# EAGLE board base (EAGLE 9.5.1)
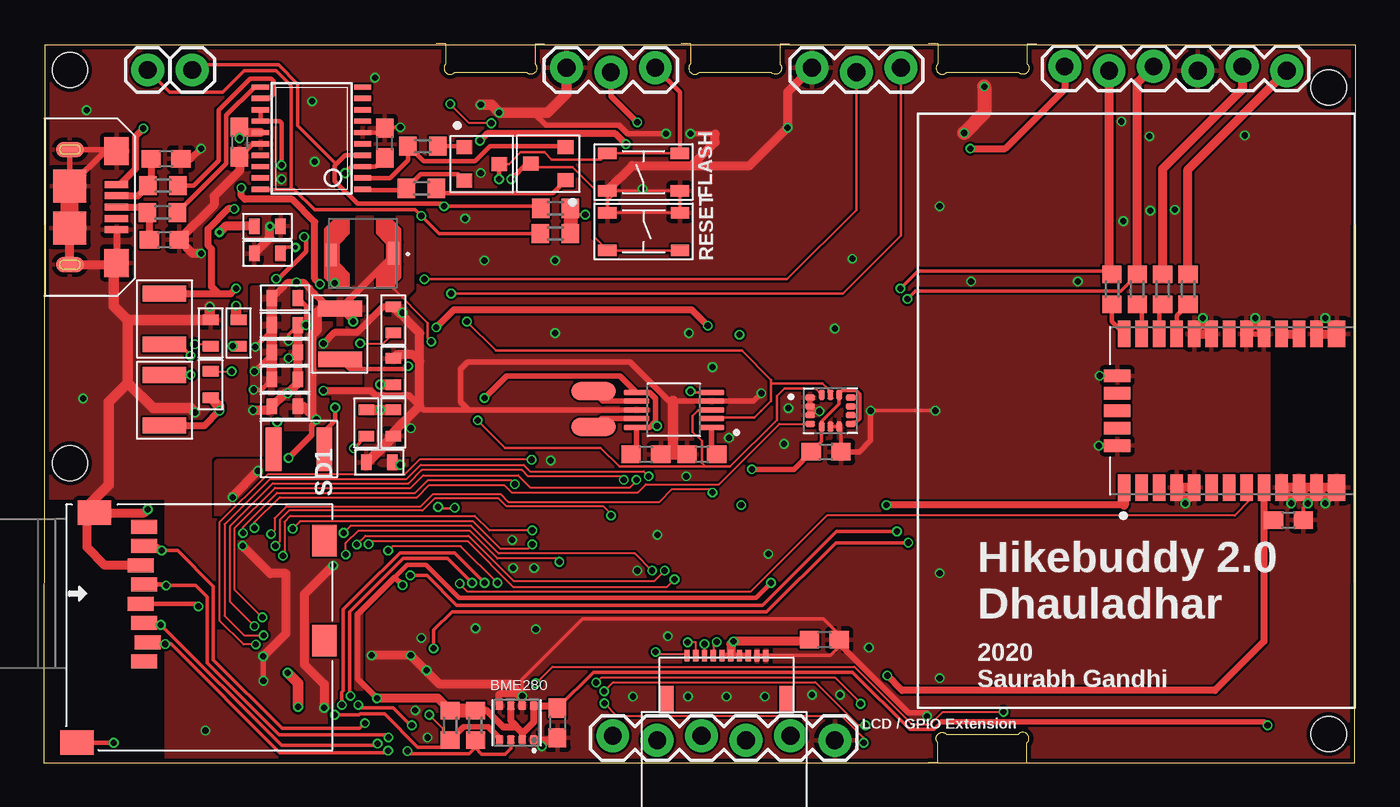
[diagram p2: board, top side]
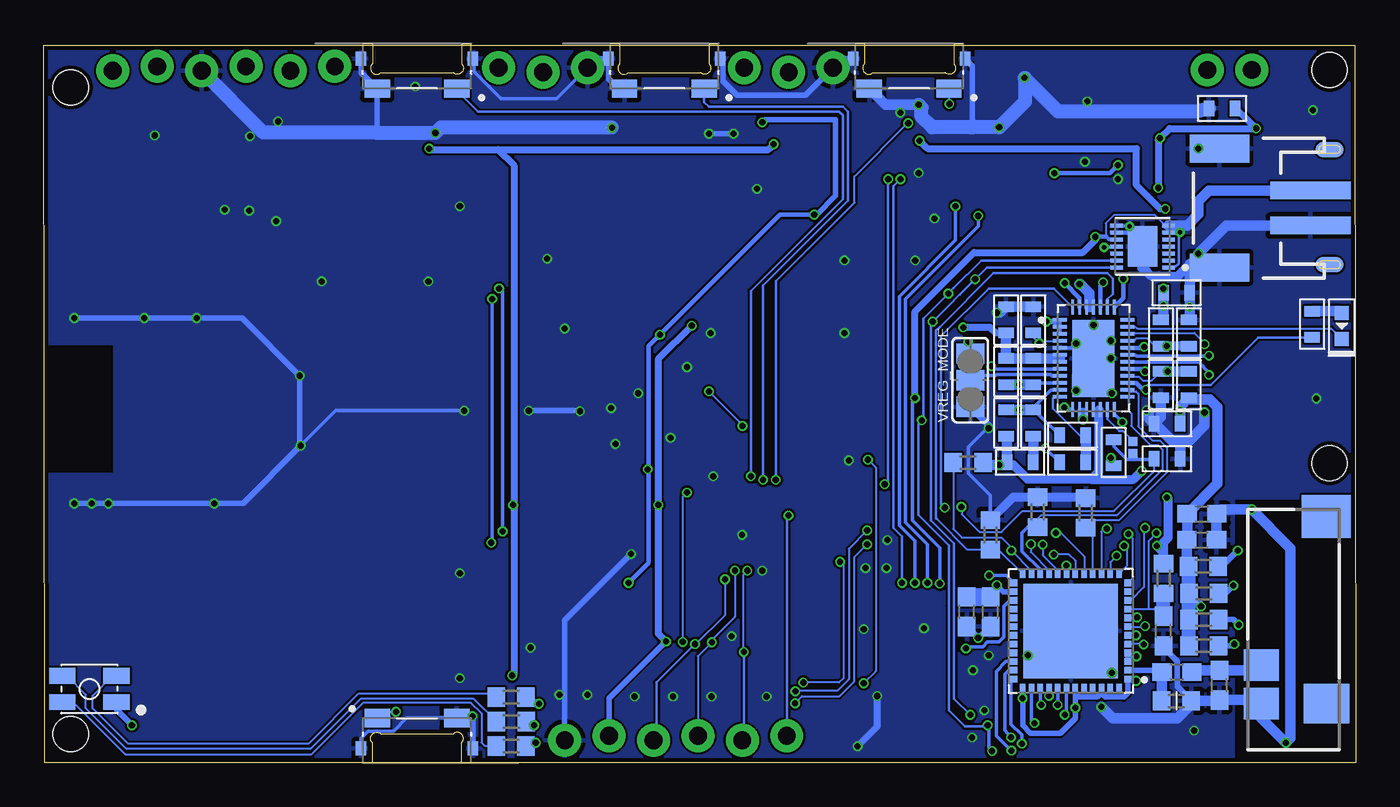
[diagram p3: board, bottom side, seen from below]

Size 75.05 x 41.05 mm. Coordinates in mm from the lower left corner, seen from the top.
Outline: 0,0 75,0 75.05,41.05 0.05,41.05 0,0
Copper layers (1*16): Top 0.035mm / dielectric 1.5mm / Bottom 0.035mm
Design rules "MF_4_mil_drill_2_Layer": minimum track width 5mil, minimum drill 4mil, track to track 5mil, track to pad 5mil, pad to pad 5mil, via to via 5mil, smd to smd 0mil, copper to edge 10mil, drill to drill 10mil, minimum pad ring 4mil, minimum via ring 4mil, stop-mask expansion 2mil, vias tented up to drill 25mil, thermal gap 10mil
Holes 2 mm at 73.5,38.65 73.5,1.65 1.5,39.65 1.5,17.15
tKeepout: area 71,18.1 to 75,22.1
bKeepout: area 71,18.1 to 75,22.1

## Footprints (pad centres in the part's own frame; a part is rotated, then mirrored left to right if it is on the bottom)
PRO-OB-440_1 = smd 2 x 1.8: 1 1.865,-2.65; 2 1.865,-4.85 | smd 2.6 x 2.25: 3 -1.865,-2.65 | smd 2.8 x 2.45: 4 -1.865,-13.35
JST-2-SMD = smd 1 x 4.6: 1 -1,-3.7; 2 1,-3.7 | smd 1.6 x 3.4: NC1 -3.4,1.5; NC2 3.4,1.5
PSON65P250X250X100-8N = smd 0.49 x 0.45: 1 0.97,0.975; 2 0.97,0.325; 3 0.97,-0.325; 4 0.97,-0.975; 5 -0.97,-0.975; 6 -0.97,-0.325; 7 -0.97,0.325; 8 -0.97,0.975
C0603 = smd 1.1 x 1: 1 -0.85,0; 2 0.85,0
C0603' = smd 0.6 x 0.9: P$1 -0.75,0; P$2 0.75,0
LED0603 = smd 0.8 x 0.8: ANODE 0.75,0; CATHODE -0.75,0
PLCC4 = smd 1.5 x 0.9: P$1 -1.55,0.75; P$2 -1.55,-0.75; P$3 1.55,-0.75; P$4 1.55,0.75
PQFN50P700X700X104-49N = smd 0.45 x 0.35: 1 -3.265,2.75; 2 -3.265,2.25; 3 -3.265,1.75; 4 -3.265,1.25; 5 -3.265,0.75; 6 -3.265,0.25; 7 -3.265,-0.25; 8 -3.265,-0.75; 9 -3.265,-1.25; 10 -3.265,-1.75; 11 -3.265,-2.25; 12 -3.265,-2.75; 25 3.265,-2.75; 26 3.265,-2.25; 27 3.265,-1.75; 28 3.265,-1.25; 29 3.265,-0.75; 30 3.265,-0.25; 31 3.265,0.25; 32 3.265,0.75; 33 3.265,1.25; 34 3.265,1.75; 35 3.265,2.25; 36 3.265,2.75 | smd 0.35 x 0.45: 13 -2.75,-3.265; 14 -2.25,-3.265; 15 -1.75,-3.265; 16 -1.25,-3.265; 17 -0.75,-3.265; 18 -0.25,-3.265; 19 0.25,-3.265; 20 0.75,-3.265; 21 1.25,-3.265; 22 1.75,-3.265; 23 2.25,-3.265; 24 2.75,-3.265; 37 2.75,3.265; 38 2.25,3.265; 39 1.75,3.265; 40 1.25,3.265; 41 0.75,3.265; 42 0.25,3.265; 43 -0.25,3.265; 44 -0.75,3.265; 45 -1.25,3.265; 46 -1.75,3.265; 47 -2.25,3.265; 48 -2.75,3.265 | smd 5.4 x 5.4: 49 0,0
TACT4.2MM = smd 1.05 x 0.65: P$1 -2.075,1.075; P$2 2.075,1.075; P$3 -2.075,-1.075; P$4 2.075,-1.075
TSSOP20 = smd 0.305 x 0.991: 1 -2.925,-2.918; 2 -2.275,-2.918; 3 -1.625,-2.918; 4 -0.975,-2.918; 5 -0.325,-2.918; 6 0.325,-2.918; 7 0.975,-2.918; 8 1.625,-2.918; 9 2.275,-2.918; 10 2.925,-2.918; 11 2.925,2.918; 12 2.275,2.918; 13 1.625,2.918; 14 0.975,2.918; 15 0.325,2.918; 16 -0.325,2.918; 17 -0.975,2.918; 18 -1.625,2.918; 19 -2.275,2.918; 20 -2.925,2.918
MICROUSB-RIGHT = smd 0.4 x 1.35: 1 -1.3,1.27; 2 -0.65,1.27; 3 0,1.27; 4 0.65,1.27; 5 1.3,1.27 | smd 0.9 x 1.6: S1 -3.3,-1.4; S2 3.3,-1.4 | smd 1.6 x 1.4: S3 -3.2,1.27; S4 3.2,1.27 | smd 1.9 x 1.9: S5 -1.2,-1.405; S6 1.2,-1.405 | smd 0.9 x 1.6 bottom: S7 -3.3,-1.4; S8 3.3,-1.4
1X06_LOCK = drill 1.016 pad 1.88: 1 0,0; 2 2.54,-0.254; 3 5.08,0; 4 7.62,-0.254; 5 10.16,0; 6 12.7,-0.254
1X03_LOCK = drill 1.016 pad 1.88: 1 0,0.127; 2 2.54,-0.127; 3 5.08,0.127
SOLDER_PAD_2 = smd 1.016 x 2.54: P$1 -1.016,0; P$2 1.016,0
1X01 = drill 1.016 pad 1.88: 1 0,0
L0603 = smd 1 x 1.1: 1 -0.85,0; 2 0.85,0
INDP_LPS4018-472MRB = smd 0.635 x 1.27: 1 -1.77,0; 2 1.81,0.1
L1210 = smd 0.9 x 2.5: P$1 -1.45,0; P$2 1.45,0
R0603 = smd 1 x 1.1: 1 -0.85,0; 2 0.85,0
R0603' = smd 0.6 x 0.9: P$1 -0.75,0; P$2 0.75,0
SW_EVQ-P4HB3B = smd 1.45 x 1.05: 1 -2.275,0.875; 2 2.275,0.875 | smd 0.6 x 0.8: 3 -3.2,-0.85; 4 3.2,-0.85
MF-MICROSD = smd 1.4 x 1.9: G0 -6.589,7.001; G1 6.561,6.001 | smd 0.8 x 1.5: PIN1 -1.939,3.151; PIN2 -0.839,2.951; PIN3 0.261,3.151; PIN4 1.361,3.351; PIN5 2.461,3.151; PIN6 3.561,3.351; PIN7 4.661,3.151; PIN8 5.761,3.151 | smd 1.8 x 1.4: PIN9 4.961,-7.149; PIN10 -0.739,-7.149
PAD.02X.02 = smd 0.508 x 0.508: P$1 0,0
QFN40P600X400X80-39N = smd 0.86 x 0.22: 1 -1.935,2.2; 2 -1.935,1.8; 3 -1.935,1.4; 4 -1.935,1; 5 -1.935,0.6; 6 -1.935,0.2; 7 -1.935,-0.2; 8 -1.935,-0.6; 9 -1.935,-1; 10 -1.935,-1.4; 11 -1.935,-1.8; 12 -1.935,-2.2; 20 1.935,-2.2; 21 1.935,-1.8; 22 1.935,-1.4; 23 1.935,-1; 24 1.935,-0.6; 25 1.935,-0.2; 26 1.935,0.2; 27 1.935,0.6; 28 1.935,1; 29 1.935,1.4; 30 1.935,1.8; 31 1.935,2.2 | smd 0.22 x 0.86: 13 -1.2,-2.935; 14 -0.8,-2.935; 15 -0.4,-2.935; 16 0,-2.935; 17 0.4,-2.935; 18 0.8,-2.935; 19 1.2,-2.935; 32 1.2,2.935; 33 0.8,2.935; 34 0.4,2.935; 35 0,2.935; 36 -0.4,2.935; 37 -0.8,2.935; 38 -1.2,2.935 | smd 2.4 x 4.4: 39 0,0
SON40P300X300X80-15N = smd 0.76 x 0.22: 1 -1.485,1.2; 2 -1.485,0.8; 3 -1.485,0.4; 4 -1.485,0; 5 -1.485,-0.4; 6 -1.485,-0.8; 7 -1.485,-1.2; 8 1.485,-1.2; 9 1.485,-0.8; 10 1.485,-0.4; 11 1.485,0; 12 1.485,0.4; 13 1.485,0.8; 14 1.485,1.2 | smd 1.7 x 2.3: 15 0,0
SOT-23-3 = smd 0.9 x 0.8: P$1 -1,0.95; P$2 -1,-0.95; P$3 1,0
SOP50P490X110-10N = smd 1.44 x 0.3: 1 -2.145,1; 2 -2.145,0.5; 3 -2.145,0; 4 -2.145,-0.5; 5 -2.145,-1; 6 2.145,-1; 7 2.145,-0.5; 8 2.145,0; 9 2.145,0.5; 10 2.145,1
PQFN50P250X300X100-14N = smd 0.58 x 0.35: 1 -1.16,0.75; 2 -1.16,0.25; 3 -1.16,-0.25; 4 -1.16,-0.75; 8 1.16,-0.75; 9 1.16,-0.25; 10 1.16,0.25; 11 1.16,0.75 | smd 0.35 x 0.58: 5 -0.5,-0.91; 6 0,-0.91; 7 0.5,-0.91; 12 0.5,0.91; 13 0,0.91; 14 -0.5,0.91
FH12-10S-0.5SH = smd 0.3 x 0.655: DISP -0.25,5.25; EXTCOMIN -0.75,5.25; EXTMODE 1.25,5.25; SCLK -2.25,5.25; SCS -1.25,5.25; SI -1.75,5.25; VDD 0.75,5.25; VDDA 0.25,5.25; VSS 1.75,5.25; VSSA 2.25,5.25 | smd 0.85 x 1.5: P$1 -3.45,2.75; P$2 3.45,2.75
LCC100P960X1400X210-31N = smd 1.5 x 0.7: 1 4.4,-6.2; 2 4.4,-5.2; 3 4.4,-4.2; 4 4.4,-3.2; 5 4.4,-2.2; 6 4.4,-1.2; 7 4.4,-0.2; 8 4.4,0.8; 9 4.4,1.8; 10 4.4,2.8; 11 4.4,3.8; 12 4.4,4.8; 15 -4.4,4.8; 16 -4.4,3.8; 17 -4.4,2.8; 18 -4.4,1.8; 19 -4.4,0.8; 20 -4.4,-0.2; 21 -4.4,-1.2; 22 -4.4,-2.2; 23 -4.4,-3.2; 24 -4.4,-4.2; 25 -4.4,-5.2; 26 -4.4,-6.2 | smd 1.5 x 1: 13 4.4,5.95; 14 -4.4,5.95 | smd 0.7 x 1.5: 27 -2,-6.6; 28 -1,-6.6; 29 0,-6.6; 30 1,-6.6; 31 2,-6.6
SJ_2 = smd 1.168 x 1.6: 1 -1.524,0; 2 0,0; 3 1.524,0

## Placement (x,y rotation side)
ANT  PRO-OB-440  [PRO-OB-440_1]  3.55,0.75 180 bottom
BATTERY1  S2B-PH-SM4-TB(LF)(SN)  [JST-2-SMD]  6.3,31.75 90 bottom
BME280  BME280  [PSON65P250X250X100-8N]  27.05,2.3 270 top
C1  4.7pF  [C0603]  10.23,5.21 0 bottom
C2  4.7pF  [C0603]  7.8,4.45 90 bottom
C3  0.1uF  [C0603]  11,7.55 90 bottom
C4  0.1uF  [C0603]  19.5,35.47 90 top
C5  47pF  [C0603]  7,34.57 0 top
C6  47pF  [C0603]  6.89,29.93 0 top
C7  10uF  [C0603]  11.21,35.53 270 top
C8  10uF  [C0603]  22.25,8.65 90 bottom
C9  10uF  [C0603']  7.65,37.45 180 bottom
C10  0.1uF  [C0603']  20,25.35 270 top
C11  22uF  [C0603']  18.45,22.4 90 bottom
C12  22uF  [C0603']  13.8,26.6 180 top
C13  10pF  [C0603']  11.15,24.6 270 bottom
C14  0.1uF  [C0603]  8.8,14.25 0 bottom
C15  0.1uF  [C0603]  8.82,12.76 0 bottom
C16  10uF  [C0603']  10.25,26.9 180 bottom
C17  4.7uF  [C0603]  71.2,13.9 0 top
C18  10pF  [C0603']  9.55,21.65 90 bottom
C19  4.7uF  [C0603]  44.65,7.05 180 top
C20  0.1uF  [C0603']  10.8,17.4 180 bottom
C21  10uF  [C0603]  44.75,17.8 0 top
C23  10uF  [C0603]  29.39,2.29 270 top
C24  10uF  [C0603']  10.8,19.4 180 bottom
C25  1uF  [C0603']  13.8,25.05 180 top
C26  1uF  [C0603']  13.8,23.5 180 top
C27  10uF  [C0603']  13.8,21.95 180 top
C28  10uF  [C0603']  13.8,20.4 0 top
C29  22uF  [C0603']  20,25.35 270 bottom
C30  22uF  [C0603']  19.2,17.2 180 top
C31  33pF  [C0603']  18.45,19.45 270 bottom
C32  330pF  [C0603']  18.45,19.45 270 top
C33  10pF  [C0603']  16.2,18.75 0 bottom
C34  0.47uF  [C0603']  12.8,29.15 0 top
C35  0.1uF  [C0603']  12.8,30.7 180 top
C36  4.7uF  [C0603]  37.65,17.65 180 top
C37  4.7uF  [C0603]  34.45,17.65 180 top
C38  10uF  [C0603]  20.9,8.65 90 bottom
D1  MF-LED-0603-RED  [LED0603]  0.8,25 90 bottom
D4  MF-LED-3228-RGB  [PLCC4]  72.44,4.23 180 bottom
ESP32-PICO-D4  ESP32-PICO-D4  [PQFN50P700X700X104-49N]  16.3,7.55 180 bottom
FLASH  MF-SW-TACT-4.2MM  [TACT4.2MM]  34.31,33.8 0 top
FT231  FT231XS  [TSSOP20]  15.32,35.74 90 top
J1  MF-CON-MICROUSB-RIGHT  [MICROUSB-RIGHT]  2.9,31.8 270 top
J2  GPS Port  [1X06_LOCK]  71.1,39.6 180 top
J3  [1X03_LOCK]  43.95,39.65 0 top
J4  [1X03_LOCK]  29.9,39.65 0 top
J5  SOLDER_PAD_2  [SOLDER_PAD_2]  31.45,20.25 270 top
J6  [1X01]  5.95,39.65 0 top
J7  [1X01]  8.5,39.65 0 top
J8  [1X06_LOCK]  45.25,1.3 180 top
L1  30Ω/1.8A  [L0603]  10.26,3.55 0 bottom
L2  3.3uH  [INDP_LPS4018-472MRB]  18.25,29.15 180 top
L3  2.2uH  [L1210]  14.6,17.95 0 top
L4  4.7uH  [L1210]  6.9,25.4 270 top
L5  2.2uH  [L1210]  16.95,24.55 90 top
L6  4.7uH  [L1210]  6.9,20.75 270 top
R1  10k  [R0603]  11,10.55 90 bottom
R2  10k  [R0603]  22.18,17.18 0 bottom
R3  27  [R0603]  6.83,33.03 0 top
R4  27  [R0603]  6.79,31.49 0 top
R5  10k  [R0603]  21.68,35.29 0 top
R6  10k  [R0603]  21.61,32.88 0 top
R7  2K  [R0603']  9.55,24.6 270 top
R8  3K  [R0603']  18.45,25.35 270 bottom
R9  560K  [R0603']  20,22.4 90 bottom
R10  1k  [R0603]  29.28,31.73 0 top
R11  1k  [R0603]  29.27,30.29 0 top
R12  10k  [R0603]  8.7,6.7 180 bottom
R13  10k  [R0603]  8.7,8.2 180 bottom
R14  10k  [R0603]  8.7,9.7 180 bottom
R15  100  [R0603]  62.55,27.1 270 top
R16  1K  [R0603']  13.85,17.75 90 bottom
R17  100  [R0603]  61.1,27.1 90 top
R18  100  [R0603]  65.45,27.1 90 top
R19  100  [R0603]  64,27.1 90 top
R20  100K  [R0603']  20,22.4 270 top
R21  1K  [R0603']  2.5,25.1 270 bottom
R22  220K  [R0603']  9.55,24.6 90 bottom
R23  680K  [R0603']  11.15,24.6 270 top
R24  220K  [R0603']  11.15,21.65 270 bottom
R25  680K  [R0603']  9.55,21.65 90 top
R26  680K  [R0603']  20,19.45 270 bottom
R27  220K  [R0603']  20,19.45 90 top
R28  121K  [R0603']  19.2,17.2 180 bottom
R29  15K  [R0603']  16.2,17.2 0 bottom
R30  10k  [R0603]  18.2,14.35 270 bottom
R31  10k  [R0603]  15.45,14.3 270 bottom
R36  10k  [R0603]  20.9,13.05 270 bottom
R37  2K  [R0603]  23.25,2.15 90 top
R38  2K  [R0603]  24.7,2.15 90 top
R40  1k  [R0603]  48.31,3.77 180 bottom
R41  1k  [R0603]  48.31,0.97 180 bottom
R42  1k  [R0603]  48.3,2.37 180 bottom
R43  10k  [R0603]  8.72,11.25 180 bottom
RESET  MF-SW-TACT-4.2MM  [TACT4.2MM]  34.32,30.4 180 top
S1  EVQ-P4HB3B  [SW_EVQ-P4HB3B]  53.7,1.7 0 bottom
S2  EVQ-P4HB3B  [SW_EVQ-P4HB3B]  39.55,39.45 180 bottom
S3  EVQ-P4HB3B  [SW_EVQ-P4HB3B]  25.55,39.45 180 bottom
S4  EVQ-P4HB3B  [SW_EVQ-P4HB3B]  53.7,39.45 180 bottom
SD1  MF-MICROSD  [MF-MICROSD]  8.9,7.75 90 top
TP1  TEST-POINT2  [PAD.02X.02]  12.75,17.7 0 bottom
TP2  TEST-POINT2  [PAD.02X.02]  12.75,18.4 0 bottom
U1  LTC3586EUFE-1#PBF  [QFN40P600X400X80-39N]  15,23.15 0 bottom
U2  MAX17260SETD+  [SON40P300X300X80-15N]  12.2,29.55 180 bottom
U3  MF-DSC-SOT233-MMBT3904  [SOT-23-3]  25.05,34.27 0 top
U4  MF-DSC-SOT233-MMBT3904  [SOT-23-3]  28.86,34.28 180 top
U5  DRV2605LTDGSRQ1  [SOP50P490X110-10N]  36.05,20.2 180 top
U6  BMX160  [PQFN50P250X300X100-14N]  45,20.15 0 top
U$5  51441-1093  [FH12-10S-0.5SH]  39.05,0.9 0 top
UBLOX_GPS  CAM-M8C-0  [LCC100P960X1400X210-31N]  68,20.15 270 top
VREG_MODE  VREG MODE  [SJ_2]  22.05,21.9 90 bottom

## Tracks (layer width: path | path; a pad name or v marks a point on that pad's centre or on a via)
3V3_GPS  (via drill 0.35)
  Top 0.2: 70.3,13.85 C17.1
  Top 0.305: 69.8,14.35 70.3,13.85
  Top 0.406: L4.P$1 10,26.85 | 10,26.85 10.7,26.85 v11,27.15 | 10,26.85 9.61,27.24 9.61,29.4 9.4,29.61 9.4,30.56 10.54,31.7 v10.9,31.7 | J2.6 58.4,38.55 55,35.15 v53,35.15 | v24.95,35.6 25.35,36 32.7,36 v33.3,35.4 | UBLOX_GPS.9 69.8,14.35 69.8,6.95 67,4.15 49.1,4.15 v48.25,5 | 61.8,14.75 v48.2,14.75
  Top 0.508: UBLOX_GPS.1 61.8,14.75
  Top 0.61: R23.P$1 11,25.5 v11,26.15
  Bottom 0.305: 48.15,14.7 v48.2,14.75 48.15,14.8 | 52.95,35.1 49.05,35.1
  Bottom 0.406: v11,27.15 C16.P$2 | v10.9,31.7 11.2,31.7 12.55,33.05 12.55,35.15 24.5,35.15 v24.95,35.6 | v53,35.15 52.95,35.1 33.6,35.1 v33.3,35.4 | 48.15,14.7 48.15,5.1 v48.25,5 | 48.15,14.8 48.15,34.2 49.05,35.1
  Bottom 0.61: C16.P$2 v11,26.15 11,25.5 R23.P$1
3V3_SDC  (via drill 0.35)
  Top 0.254: SD1.PIN4 8.69,9.11 v8.85,8.95
  Top 0.406: L6.P$2 9.2,19.3 v10.05,20.15
  Top 0.61: R25.P$1 10.05,20.4 v10.05,20.15
  Bottom 0.508: v8.85,8.95 9.05,9.15 9.55,9.15
  Bottom 0.61: v10.05,20.15 C24.P$1 10.05,20.4 R25.P$1 9.44,20.79 8.35,20.79 7.91,20.36 7.91,15.99 C14.1 9.65,12.78 C15.1 9.67,11.35 9.55,11.23
  Bottom 0.813: R12.2 R13.2 9.55,9.15 R14.2 9.55,11.23 R43.2
BMX_INT  (via drill 0.35)
  Top 0.127: v12.05,13.45 12.05,13.75 13.5,15.2 21.36,15.2 22.05,15.9 26.34,15.9 26.76,15.48 33.99,15.48 34.44,15.93 38.62,15.93 42.08,19.4 U6.4
  Bottom 0.127: ESP32-PICO-D4.10 13,9.34 12.84,9.34 12.12,10.06 12.12,13.38 v12.05,13.45
D+
  Top 0.406: J1.3 5.63,31.8 R4.1 6.04,31.39 C6.1
D-
  Top 0.406: J1.2 5.4,32.45 R3.1 6.14,33.2 C5.1
EN_GPS
  Bottom 0.127: U1.21 12.97,21.25 12.57,21.25 12.44,21.12 12.44,19.25 11.63,18.45 11.22,18.45 10.81,18.03 10.81,16.62 13.55,13.88 15.03,13.88 R31.2 15.05,13.05 ESP32-PICO-D4.16
EN_LCD
  Bottom 0.127: ESP32-PICO-D4.24 20.43,12.2 R36.2 22.2,12.2 23.95,13.95
  Bottom 0.15: 23.95,13.95 24.01,14 24.01,24.74 23.8,24.95
  Bottom 0.152: U1.33 14.2,26.54 13.9,26.84 13.9,27.72 14.2,28.02 20.73,28.02 23.8,24.95
EN_SDC
  Bottom 0.127: U1.20 13,20.89 13,20.15 12.85,20 12.85,19.29 11.75,18.19 11.32,18.19 11.06,17.93 11.06,16.78 13.68,14.16 18.01,14.16 18.2,13.97 R30.2
  Bottom 0.203: R30.2 18.75,13.5 19.1,13.15 19.1,12.12 18.05,11.06 ESP32-PICO-D4.22
ESP_EN  (via drill 0.35)
  Top 0.127: v11.4,13.15 11.4,13.5 13.35,15.45 21.25,15.45 21.95,16.15 26.75,16.15 v26.95,15.95
  Top 0.15: U4.P$3 28.05,34.08 30.24,34.08 31.49,32.83 31.49,30.07 RESET.P$2 RESET.P$1
  Top 0.254: U4.P$3 27.63,34.28 v26.75,33.4
  Bottom 0.127: ESP32-PICO-D4.9 11.85,8.8 | 11.85,8.8 11.39,8.8 | v11.4,13.15 11.85,12.7 11.85,8.8
  Bottom 0.15: v26.75,33.4 26.75,16.15 v26.95,15.95
  Bottom 0.305: 11.39,8.8 C3.2
  Bottom 0.813: C3.2 R1.1
ESP_FLASH  (via drill 0.35)
  Top 0.127: v25.95,10.3 23.85,12.4 19.95,12.4 v19.7,12.15
  Top 0.15: U3.P$3 26.61,34.27 27.27,34.93 28.64,34.93 29.04,34.53 31.88,34.53 FLASH.P$1 FLASH.P$2
  Top 0.254: U3.P$3 v26.05,33.41 v26.05,33.4 | FLASH.P$2 36.38,38.37 J4.3
  Bottom 0.127: ESP32-PICO-D4.23 18.55,11 v19.7,12.15 19.7,12.32 20.27,12.89 22.54,12.89 23.03,13.38 R2.1
  Bottom 0.15: v26.05,33.4 26.45,33 26.45,13.45 25.95,12.95 v25.95,10.3
ESP_RX  (via drill 0.35)
  Top 0.2: FT231.20 14.34,32.81 15.5,31.65 21.25,31.65 v21.6,31.3 22.61,30.29 R11.1 | 19,10.15 20.55,11.7 23.1,11.7 v24.5,10.3 | 13.3,39.61 11.46,39.61 10.23,38.38 7.22,38.38 5.99,39.61
  Top 0.203: v17.55,3.83 17.5,3.88 17.5,8.65 19,10.15 | 5.99,39.61 J6.1 | 13.3,39.61 14.15,38.75 14.15,32.81 FT231.20
  Bottom 0.2: v21.6,31.3 21.6,30.7 25.75,26.55 25.75,13.75 24.5,12.5 v24.5,10.3
  Bottom 0.203: ESP32-PICO-D4.40 v17.55,3.83
ESP_TX  (via drill 0.35)
  Top 0.127: 22.75,32 v22.9,31.85
  Top 0.2: 18.25,9.9 20.38,12.03 23.49,12.03 v25.21,10.3 | v22.9,31.85 28.3,31.85 R10.1 | 16.74,34.26 14.53,36.47 14.53,38.83 13.43,39.93 8.78,39.93 J7.1
  Top 0.203: 18.25,9.9 17.13,8.78 17.13,4.13 17.05,4.04 17.05,3.62 17.05,3.61 v17.05,3.32
  Top 0.254: 22.75,32 17.95,32 16.65,33.3 16.65,34.17 16.74,34.26 17.24,34.76 FT231.4
  Bottom 0.2: v22.9,31.85 22.9,29.9 26.12,26.68 26.12,13.6 25.21,12.7 v25.21,10.3
  Bottom 0.203: ESP32-PICO-D4.41 17.05,4.05 17.05,4.04 17.05,3.33 v17.05,3.32
GND  (via drill 0.25 pad 0.55, 0.35)
  Top 0.127: U$5.VSS 41,6.15 U$5.VSSA
  Top 0.15: FLASH.P$3 32.24,32.72 32.24,32.15 | 32.24,32.15 RESET.P$4 RESET.P$3 36.38,31.49 FLASH.P$4 32.82,32.73 32.24,32.15
  Top 0.2: C26.P$1 14.35,23.5 v14,23.15 | C25.P$1 14,24.5 v14,24.15 | v47.3,20.15 v51,20.15 | C17.2 72.05,14.6 v72.3,14.85 | U6.6 U6.7 45.6,19.14 C21.2
  Top 0.203: v12.93,30.7 C35.P$1 | 27.37,3.63 27.37,4.79 30.83,8.25 44.6,8.25 45.5,7.35 C19.1 45.5,6.65 45,6.15 41,6.15 | C4.2 19.55,36.37 v20.4,36.37
  Top 0.254: C12.P$1 15,26.15 v15,25.05 | FT231.16 11.94,35.41 C7.2 | C4.2 19.25,36.06 FT231.6 | SD1.G0 v4,1.15
  Top 0.305: 24.31,20.2 23.86,20.66 23.86,22.54 24.24,22.93 33.53,22.93 35.76,20.7 36,20.7 U5.4 40.6,20.7 v41.05,21.15 | U5.8 24.31,20.2 | 24.31,20.2 21.73,20.2 21.51,20.42 | v50.52,2.67 50.52,2.88 49.47,2.88 45.5,6.85 | UBLOX_GPS.22 66.3,25.05 | 66.3,25.05 v66.3,25.45 | UBLOX_GPS.21 66.3,25.05 | 69.3,25.05 UBLOX_GPS.19 UBLOX_GPS.18 69.3,25.05 | 69.3,25.05 v69.3,25.45 | UBLOX_GPS.13 73.95,15.5 v73.3,14.85 73.3,15.25 UBLOX_GPS.12 72.8,15.35 v72.3,14.85 72.3,15.25 UBLOX_GPS.11 71.8,15.3 v71.35,14.85 71.35,15.2 UBLOX_GPS.10 | UBLOX_GPS.5 65.8,15.35 v65.3,14.85 65.3,15.25 UBLOX_GPS.4 | UBLOX_GPS.31 v60.35,18.15 | UBLOX_GPS.27 v60.4,22.15 | J1.S5 3.6,35.1 | 3.6,35.1 4.07,35.1 | J1.S5 J1.S1 3.6,35.1 | v47.3,20.15 47.3,18.45 46.65,17.8 C21.2 | U6.3 43.84,20.15 | 43.84,20.15 U6.2 U6.1 | 43.84,20.15 43.87,20.12 v44.38,20.12 | 28,37.2 28.72,36.48 32.9,36.48 33.38,36 v35.6,36 | v37,36 38.4,36
  Top 0.406: J1.5 J1.S4 | C5.2 8.42,34.57 v9,35.15 | v16,23.99 16.65,24.64 17.95,24.64 19.41,26.1 C29.P$1 | v16,21.3 18.7,21.3 18.99,21.02 20.91,21.02 21.51,20.42 | v21,19.15 20.62,19.53 | C23.2 29.28,1.33 28.88,1.33 | BME280.5 26.05,3.29 26.05,3.95 27.05,3.95 27.37,3.63 | v28.5,0.95 28.88,1.33 | BME280.1 28.88,1.33 | BME280.7 27.37,3.63 | 27.37,3.63 v27.37,3.82 v27.38,3.83
  Top 0.508: C34.P$1 12.93,30.03 v12.93,30.7 | v9,29.15 8.52,29.15 C6.2 9.74,31.93 9.74,32.42 11.21,33.88 C7.2 | 21.51,22.97 21.12,23.36 20.21,23.36 R20.P$1 | R27.P$1 20,18.91 20.62,19.53 21.51,20.42 21.51,22.97 | 21.51,22.97 21.51,24.59 C29.P$1 | v15,25.05 C25.P$1 C26.P$1 C27.P$1 14.55,21.75 v13.95,21.15 13.8,21.15 C28.P$1 | UBLOX_GPS.22 UBLOX_GPS.21 | UBLOX_GPS.15 UBLOX_GPS.14 | UBLOX_GPS.13 UBLOX_GPS.12 UBLOX_GPS.11 UBLOX_GPS.10 | UBLOX_GPS.5 UBLOX_GPS.4 | v18.76,6.15 v21,6.15 22.65,4.5 26.69,4.5 v27.37,3.82 | v11.97,20.18 12.83,20.18 | 4.07,28.5 J1.S2 J1.S6 | C19.1 45.5,6.85 | FLASH.P$3 33.68,34.17 37.07,34.17 | 38.4,36 38.4,35.51 37.07,34.17 | 37.07,34.17 40.37,34.17 v42.55,36.35 42.55,38.38 J3.1 | 2.48,14.68 2.48,12.34 3.5,11.31 SD1.PIN6 | SD1.G1 5.76,14.31 v5.95,14.5
  Top 0.61: v9.5,26.1 9.5,25.4 R22.P$2 4.8,25.35 | R27.P$1 18.5,17.2 C30.P$2 | 4.8,25.35 4,26.15 4,28.43 4.07,28.5 | 4.8,25.35 4.8,21.75 | v8.65,20.05 8.4,20.3 6.25,20.3 4.8,21.75 | 12.83,20.18 C28.P$1 | v20.52,25.75 20.35,25.75 C29.P$1 | 4.8,21.75 3.71,20.66 3.71,15.91 2.48,14.68 | v14.55,3.2 14.55,4.55 v13.95,5.15 | C37.1 36,17.65 | 36,17.65 C36.2 | 36,17.65 36,20.7 | v25,37.65 25.61,37.65 v26.05,37.2 28,37.2 28.8,37.2 29.9,38.3 J4.1
  Top 0.813: v53.8,38.7 53.8,37.19 v52.65,36.04
  Top 1.016: 4.07,35.1 J1.S3 | 4.07,28.5 J1.S4 | J1.S6 J1.S5
  Bottom 0.2: v14,23.15 U1.39 | v51,20.15 58.35,20.15 v60.35,18.15 | S4.3 50.45,40.25 50.45,39.54 48.9,38 45.73,38 43.86,39.86 | S1.3 56.9,1.42 56.5,1.82 55.04,1.82 54.29,2.58 S1.2 | v50.52,2.67 50.62,2.58
  Bottom 0.203: 12.25,29.6 12.93,30.28 v12.93,30.7 13.63,30.7 U2.8 | U1.5 16.3,23.75 v15,25.05 U1.39 | 20.95,19.27 21.07,19.15 22.16,18.07 22.16,16.56 20.9,15.3 R36.1
  Bottom 0.254: U2.15 12.25,29.6 13,30.35 U2.9
  Bottom 0.305: C3.1 11,6.61 10.21,5.82 10.21,4.39 9.41,3.6 L1.2 | v73.3,14.85 v72.3,14.85 v71.35,14.85 v65.3,14.85 63.65,14.85 v60.35,18.15 60.4,18.2 v60.4,22.15 63.7,25.45 v66.3,25.45 v69.3,25.45 v73.3,25.45 | J8.1 45.25,8.15 v41.45,11.95 | C38.1 21.55,7.15 v21.6,7.15 C8.1 | S3.3 21.92,39.87 21.92,36.37 | S3.4 29.38,40.3 J4.1 31.48,38.2 35.4,38.2 36.2,39 36.2,40.15 36.35,40.15 S2.3 | J3.1 43.86,39.86 43.43,40.3 S2.4 42.75,39.15 42.17,38.58 S2.2 | S4.4 56.9,39.5 S4.2 55.98,36.07 56,36.04 | S1.4 50.5,2.45 50.62,2.58 S1.2 | v44.38,20.12 44.41,20.15 v47.3,20.15 | v35.6,36 v37,36
  Bottom 0.406: VREG_MODE.1 20.95,19.27 | v21,19.15 21.07,19.15 | v28.5,0.95 27.38,2.07 v27.38,3.83
  Bottom 0.508: 9.5,28.55 10.19,27.86 11.71,27.86 12,28.15 | R31.1 15.5,15.2 R30.1 19.6,15.2 R36.1 | v18.76,6.15 17.36,7.55 ESP32-PICO-D4.49 | 11.85,20.09 11.93,20.18 v11.97,20.18 | U1.39 16,22.15 v16,21.3
  Bottom 0.61: v9.5,26.1 C16.P$1 | R22.P$2 9.5,25.4 C16.P$1 | R24.P$2 11.15,19.8 C24.P$2 | R8.P$1 C29.P$1 20.35,25.75 v20.52,25.75 | U2.15 12.2,28.35 12,28.15 | 9.5,28.55 C16.P$1 | v8.65,20.05 8.65,19.3 9.5,18.45 10,18.45 | C24.P$2 11.85,19.7 11.85,20.09 | C15.2 7.97,14.23 C14.2 7.7,14.5 v5.95,14.5 3.73,12.28 3.73,1.42 v4,1.15 5.42,2.56 ANT.1 5.62,3.6 C2.1 7.85,3.55 L1.2 9.41,3.35 10.21,2.55 13.9,2.55 v14.55,3.2 | v13.95,5.15 13.95,5.2 ESP32-PICO-D4.49 | BATTERY1.1 7.4,30.75 v9,29.15 | C24.P$2 11.47,19.4 10.52,18.45 10,18.45 | 10,18.45 10.05,18.4 C20.P$1 | S3.2 26.9,37.65 v25,37.65
  Bottom 0.813: 56,36.04 v52.65,36.04 52.34,36.35 v42.55,36.35 | 21.92,36.37 v20.4,36.37 18.93,37.84 18.93,39.18 v18.95,39.2 17.04,37.29 9.1,37.29 C9.P$2 | 22,36.37 24.22,36.37 24.83,36.98 24.83,37.48 v25,37.65 | 55.98,36.07 62.49,36.07 J2.3
  other vias: 51.25,4.85 59.15,27.55 61.65,36.7 53.05,27.55 63.25,35.85 63.3,31.6 64.7,31.65 68.7,35.9 51.25,10.85 51.25,31.85 46.25,28.85 45.25,24.85 24.7,7.7 34.25,32.85 29.25,24.6 25.2,28.75 21.9,5.3 9.25,1.85 2.25,20.85 2.45,37.35 29.25,28.75 47.2,6.6 28.15,7.65 35.1,13.05 38.25,22.65 36.9,24.6 61.75,31 24.1,31.15 25,33.75 33.7,3.8 35.7,7.25 36.85,3.8 39.05,3.8 41.25,3.8 29,17.3 33.95,11 28.05,11.15 26.85,11.15 26.8,12.75 36.75,16.4 15.35,37.85 13.6,33.4 15.5,34.4 21.25,3 21.95,1.45 42.6,20.3 42.35,18.25 39.2,18.6 43.95,3.9 45.55,3.9
  pour Bottom: 13.5,30.35 11.5,30.35 11.5,30.75 13.5,30.75
  pour Top (rank 6): 75,41.05 0,41.05 0,15.15 7,15.15 7,0 75,0 75,16.5 71,16.5 71,24 75,24
  pour Bottom (rank 6): 75,41.05 0,41.05 0,15.15 7,15.15 7,0 75,0 75,16.5 71,16.5 71,24 75,24
GPIO_EXT  (via drill 0.35)
  Top 0.127: v13.25,12.42 13.5,12.67 13.5,13.9 14.03,14.43 21.67,14.43 22.37,15.13 26.02,15.13 26.46,14.69 32,14.69 32.45,14.24 v32.45,14.15
  Bottom 0.127: ESP32-PICO-D4.13 13.1,11.26 13.1,12.27 v13.25,12.42
  Bottom 0.15: J8.6 32.55,14.05 v32.45,14.15
GPS_RESET
  Top 0.508: R18.2 65.45,33.95 J2.1
GPS_RX  (via drill 0.35)
  Top 0.2: R17.2 60.9,28.15 50,28.15 v49,27.15 | v48.8,13.25 45.35,13.25 41.13,9.03 23.62,9.03 21.93,10.72 v20.98,10.72
  Top 0.508: R17.2 60.94,28.11 J2.5
  Bottom 0.2: v49,27.15 48.95,27.15 48.8,27 v48.8,13.25 | v20.98,10.72 19.99,10.72 ESP32-PICO-D4.25
GPS_SAFEBOOT
  Top 0.508: R19.2 64,34 68.56,38.56 J2.2
GPS_TX  (via drill 0.35)
  Top 0.2: R15.1 61.6,27 49.86,27 v49.41,26.55 | v49.45,12.6 45.3,12.6 41.35,8.65 23.35,8.65 22.3,7.6 v22.3,6.55
  Top 0.508: R15.1 62.55,38.92 J2.4
  Bottom 0.2: v49.45,12.6 49.41,12.65 v49.41,26.55 | ESP32-PICO-D4.27 19.77,9.3 20.12,8.95 20.12,7.21 20.41,6.92 21.07,6.92 21.34,6.65 22.2,6.65 v22.3,6.55
I2C_SCL  (via drill 0.35)
  Top 0.15: U5.2 38.24,19.75 40.65,19.75 41.02,20.12 | 39.93,23.59 25.86,23.59 v24.2,25.25 | v21.77,27.68 42.52,27.68 46.49,31.64 J3.2
  Top 0.152: v22.05,2.75 22.85,1.95 22.85,0.9 | 41.02,20.12 41.6,20.7 41.6,21.72 | 41.6,21.72 41.6,21.92 39.93,23.59 | U6.13 44.88,21.18 44.88,21.38 44.54,21.72 41.6,21.72
  Top 0.203: v16.65,2.75 18.05,2.75 18.11,2.81 19.49,2.81 21.4,0.9 22.85,0.9 R37.1
  Top 0.305: BME280.4 26.05,1.35 26.05,1.45 25.42,2.08 24.03,2.08 R37.1
  Bottom 0.15: 22.65,26.8 v21.77,27.68 | 24.3,13.87 24.3,25.15
  Bottom 0.152: U2.14 21.1,28.35 22.65,26.8 | v21.77,27.68 v24.2,25.25 24.3,25.15 | v22.05,2.75 22.98,3.68 22.98,12.55 24.3,13.87
  Bottom 0.203: ESP32-PICO-D4.42 16.55,2.85 v16.65,2.75
I2C_SDA  (via drill 0.35)
  Top 0.15: U5.3 38.15,20.15 37.41,20.15 37.12,19.86 37.12,18.94 37.65,18.41 37.65,17.17 37.87,16.95 | 37.87,16.95 39.26,16.95 41.94,19.63 | 37.87,16.95 32.93,16.95 31.85,18.03 26.39,18.03 v24.82,19.6 | v23.3,26.85 45.7,26.85 49.03,30.18 J3.3
  Top 0.152: U6.14 44.13,21.43 42.37,21.43 41.94,21 41.94,19.63
  Top 0.2: BME280.3 26.72,0.83 26.4,0.5 25.05,0.5 24.7,0.85 R38.1
  Top 0.203: v18,3.32 18.14,3.17 19.98,3.17 21,2.15 v21.05,2.15 | R38.1 24.7,0.9 24.33,0.53 20.95,0.53 v20.8,0.68
  Bottom 0.15: 23,27.15 v23.3,26.85
  Bottom 0.152: U2.13 21.41,28.75 23,27.15 | v23.3,26.85 24.72,25.43 24.72,19.7 v24.82,19.6 25.02,19.4 25.02,14.2 23.28,12.45 23.28,9 23.28,3 22.37,2.1 21,2.1
  Bottom 0.203: ESP32-PICO-D4.39 18.05,4.05 18.05,4.04 18.05,3.38 v18,3.32 | v21.05,2.15 21,2.1 21,0.88 v20.8,0.68
JUMPER
  Bottom 0.2: 20.55,22.21 20.6,22.16 21.79,22.16 VREG_MODE.2
  Bottom 0.203: U1.9 17.39,22.15 17.44,22.21 20.55,22.21
LCD_CLK  (via drill 0.35)
  Top 0.127: U$5.SCLK 36.8,6.2 35.15,6.2 v35,6.35 | v17.15,13.16 17.55,13.56 24.45,13.56 26.03,11.98 33.82,11.98 v34.8,11
  Bottom 0.127: ESP32-PICO-D4.17 15.53,10.83 15.53,11.81 16.88,13.16 v17.15,13.16 | v34.8,11 35.05,10.75 35.05,6.4 v35,6.35
  Bottom 0.152: v35,6.35 35,1.39 J8.5
LCD_CS  (via drill 0.35)
  Top 0.127: v18.59,12.51 18.77,12.7 24.23,12.7 26.88,10.05 35.63,10.05 v36.08,10.5 | v37.8,6.8 U$5.SCS
  Bottom 0.127: ESP32-PICO-D4.21 17.52,10.85 17.52,10.99 18.59,12.06 v18.59,12.51 | v37.8,6.8 37.73,6.8 36.08,8.45 v36.08,10.5
  Bottom 0.152: v37.8,6.8 40,4.6 40,1.47 J8.3
LCD_EXTCOMM  (via drill 0.35)
  Top 0.127: v13,13.1 13.2,13.3 13.2,14 13.89,14.69 21.57,14.69 22.27,15.39 26.13,15.39 26.57,14.95 35.23,14.95 35.95,15.66 38.05,15.66 v38.25,15.47 | v38.5,6.92 38.3,6.72 U$5.EXTCOMIN
  Bottom 0.127: ESP32-PICO-D4.12 12.78,10.55 12.78,12.88 v13,13.1 | v38.25,15.47 38.5,15.22 v38.5,6.92
LCD_MOSI  (via drill 0.35)
  Top 0.127: v17.9,12.49 18.41,13 24.29,13 26.89,10.4 34.92,10.4 v35.52,11 | U$5.SI 37.3,6.9 v36.83,6.9
  Bottom 0.127: ESP32-PICO-D4.20 17.02,10.85 17.02,10.99 17.9,11.88 v17.9,12.49 | v35.52,11 35.52,8.36 36.83,7.05 v36.83,6.9 37.63,6.1 J8.4
LED1  (via drill 0.35)
  Top 0.127: v17.28,11.92 17.28,12.57 18,13.3 24.35,13.3 25.95,11.7 29.3,11.7 v29.5,11.5 | v31.6,4.6 31.87,4.87 45.28,4.87 46.72,3.43 v46.72,3.38
  Bottom 0.127: ESP32-PICO-D4.18 16.05,11.57 16.4,11.92 v17.28,11.92 | v29.5,11.5 29.3,11.3 29.3,4.85 29.55,4.6 v31.6,4.6 | R40.1 47.12,3.77 v46.72,3.38
LED2  (via drill 0.35)
  Top 0.127: v27.95,12.5 27.7,12.25 26.13,12.25 24.55,13.83 14.67,13.83 v14.24,13.4 | v46.9,1.15 46.9,1.45 45.64,2.71 32.78,2.71 v32.07,3.41
  Bottom 0.127: ESP32-PICO-D4.15 14.57,10.83 14.57,13.23 14.31,13.48 v14.24,13.4 | v27.95,12.5 28.7,11.75 28.7,4.65 29.54,3.81 31.67,3.81 v32.07,3.41 | v46.9,1.15 47.29,1.15 R41.1
LED3  (via drill 0.35)
  Top 0.127: v13.68,11.85 13.77,11.85 13.77,13.8 14.1,14.13 24.66,14.13 25.49,13.3 v27.95,13.3 | v32.06,4.09 32.58,4.61 44.14,4.61 46.6,2.15 v47,2.15
  Bottom 0.127: v13.68,11.85 14.05,11.48 ESP32-PICO-D4.14 | v27.95,13.3 29,12.25 29,4.79 29.66,4.13 32.02,4.13 v32.06,4.09 | v47,2.15 47.23,2.15 R42.1
N$1
  Bottom 0.305: ESP32-PICO-D4.2 11.17,5.3 C1.1
  Bottom 0.61: C1.1 11.08,3.58 L1.1
N$2
  Bottom 0.61: ANT.2 5.71,5.3 C2.2 9.29,5.3 C1.2
N$3
  Top 0.254: R5.2 23.98,35.29 U3.P$1
N$4
  Top 0.254: U4.P$1 29.14,32.61 22.72,32.61 R6.2
N$5  (via drill 0.35)
  Top 0.254: FT231.13 FT231.14 13.49,36.71 13.6,36.6 v13.6,34.2 | v17.24,33.74 17.61,34.11 FT231.3 19,34.11 C4.1
  Bottom 0.254: v17.24,33.74 14.06,33.74 v13.6,34.2
N$6
  Top 0.254: R3.2 8.56,33.03 10,34.46 10,37.35 11.8,39.15 13,39.15 13.15,39 13.15,38.26 12.9,38.01 FT231.12
N$7
  Top 0.254: R4.2 10.45,34.29 10.45,37.07 12.05,38.67 FT231.11
N$8
  Top 0.254: FT231.2 19.81,33.46 20.84,34.49 R5.1 20.88,35.29 21.73,34.43 24.68,34.43 25.53,35.29 29.8,35.29 U4.P$2
N$9
  Top 0.254: FT231.1 18.28,32.78 20.66,32.78 R6.1 21.56,33.68 23.69,33.68 U3.P$2
N$10  (via drill 0.35)
  Top 0.127: R7.P$2 9.45,23.95 v8.65,23.95
  Bottom 0.127: U1.29 13.02,24.6 9.23,24.6 8.65,24.02 v8.65,23.95
N$11  (via drill 0.35)
  Top 0.127: v18.1,24 19.4,24 C10.P$2
  Bottom 0.127: U1.4 17.95,24.15 v18.1,24 18.45,24.35 R8.P$2
N$12  (via drill 0.35)
  Top 0.61: R9.P$1 v19.25,21.65
  Bottom 0.203: U1.10 18.35,21.75
  Bottom 0.254: 18.35,21.75 C11.P$1
  Bottom 0.61: R9.P$1 v19.25,21.65 C11.P$1
N$13  (via drill 0.35)
  Top 0.254: v16.67,20.33 16.67,19.58 16.1,19.01 16.1,18 L3.P$2
  Bottom 0.254: U1.13 16.79,20.21 v16.67,20.33
N$14  (via drill 0.35)
  Top 0.61: R27.P$2 v19.25,20.2 C32.P$1
  Bottom 0.203: U1.11 17.43,21.35 17.45,21.34 17.44,21.34 18.45,20.33 C32.P$1 18.4,20.2 C33.P$1
  Bottom 0.61: C32.P$1 v19.25,20.2 R27.P$2
N$15  (via drill 0.35)
  Top 0.254: L2.2 16.65,28.84 v16.65,27.45
  Bottom 0.254: U1.37 15.8,26.6 v16.65,27.45
N$16
  Bottom 0.127: U1.30 12.62,24.95 12.48,24.85 1.4,24.85 D1.CATHODE
N$17
  Bottom 0.61: D1.ANODE 0.9,25.85 R21.P$1
N$18  (via drill 0.35)
  Top 0.203: v13.35,19.5 13.35,18.15 L3.P$1
  Bottom 0.203: U1.19 13.8,19.95 v13.35,19.5
N$19
  Bottom 0.152: TP2.P$1 12.75,18.44 13.32,19 13.53,19 14.2,19.67 U1.18
N$20  (via drill 0.35)
  Top 0.2: 7.75,23.95 L4.P$2
  Top 0.203: v8.4,23.3 7.75,23.95
  Bottom 0.2: U1.26 12.62,23.35 12.54,23.29 | 8.43,23.29 v8.4,23.3
  Bottom 0.203: 12.54,23.29 8.43,23.29
N$21  (via drill 0.35)
  Top 0.127: C13.P$2 v10.8,23.85
  Bottom 0.127: U1.28 12.66,24.15 12.52,24.3 11.94,24.3 11.49,23.85 C13.P$2 v10.8,23.85
  Bottom 0.508: R22.P$1 v10.8,23.85
N$22  (via drill 0.35)
  Top 0.254: v20.85,22.7 20.7,22.55 17.5,22.55 L5.P$1
  Bottom 0.203: 20.7,22.55 U1.8
  Bottom 0.254: v20.85,22.7 20.7,22.55
N$24  (via drill 0.35)
  Top 0.15: v23.51,14.6 23.46,14.55 22.65,14.55 v22.56,14.64 v22.56,14.65
  Bottom 0.127: v22.56,14.65 22.54,14.63 22.54,14.22 21.53,13.21 20.27,13.21 19.07,14.41 13.84,14.41 11.56,16.68 11.56,17.39 C20.P$2
  Bottom 0.15: U1.38 17.27,27.15 21,27.15 23.73,24.42 23.73,14.82 v23.51,14.6
  Bottom 0.152: C20.P$2 12.45,17.4 TP1.P$1
  Bottom 0.2: R16.P$2 13.85,18.1 13.1,17.35 11.6,17.35 C20.P$2
N$26  (via drill 0.35)
  Top 0.127: C18.P$2 v10.75,22.4
  Bottom 0.127: U1.23 13.02,22.1 12.41,22.1 12.19,21.88 11.67,21.88 R24.P$1
  Bottom 0.61: R24.P$1 v10.75,22.4 C18.P$2
N$27  (via drill 0.35)
  Top 0.203: v8.4,22.2 L6.P$1
  Bottom 0.203: U1.25 9.12,22.95 9.1,22.93 8.99,22.93 8.4,22.34 v8.4,22.2
N$28
  Bottom 0.127: R40.2 49.37,3.97 57.03,3.97 59.9,1.1 70.23,1.1 72.25,3.12 72.25,3.85 71.12,4.98 D4.P$2
N$29
  Top 0.254: UBLOX_GPS.25 62.8,26 R15.2
N$30
  Top 0.254: UBLOX_GPS.26 61.1,25.25 R17.1
N$31
  Bottom 0.61: C31.P$2 R28.P$1
N$32
  Bottom 0.127: D4.P$3 73.72,4.98 72.64,3.91 72.64,3.13 70.32,0.8 59.8,0.8 56.91,3.69 50.48,3.69 R42.2
N$33
  Bottom 0.127: D4.P$4 73.35,3.48 70.38,0.5 59.72,0.5 56.78,3.44 50.62,3.44 50.01,2.83 50.01,1.16 49.82,0.97 R41.2
N$34
  Top 0.508: UBLOX_GPS.17 UBLOX_GPS.16
N$37
  Top 0.254: UBLOX_GPS.23 64.8,25.6 R18.1
N$38
  Top 0.254: UBLOX_GPS.24 63.8,26.05 R19.1
N$41
  Top 0.305: U5.1 38.2,17.95 C36.1
N$43
  Bottom 0.15: 15.45,18.15 15.45,18.39 17.34,20.27 17.34,20.85 17.23,20.95 U1.12
  Bottom 0.61: R29.P$2 15.45,18.15 C33.P$2
N$44  (via drill 0.35)
  Top 0.203: v17.74,18 C32.P$2
  Bottom 0.203: R29.P$1 v17.74,18
N$47  (via drill 0.25 pad 0.55)
  Top 0.203: C34.P$2 13.9,29.5 v14.4,29.5
  Bottom 0.203: U2.11 13.73,29.5 v14.4,29.5
N$50
  Top 0.305: J5.P$2 31.92,19.7 U5.9
N$51
  Top 0.305: U5.7 32,20.7 31.45,21.25 J5.P$1
SD_CLK  (via drill 0.35)
  Top 0.203: v7,10.15 8.7,10.15 9.36,9.49 9.36,5.73 13.46,1.61 19.57,1.61 v19.72,1.46
  Top 0.254: SD1.PIN5 6.94,10.21 v7,10.15
  Bottom 0.203: ESP32-PICO-D4.35 19.85,5.3 20.07,5.08 20.07,1.85 v19.72,1.46
  Bottom 0.305: R14.1 7.45,9.7 v7,10.15 | ESP32-PICO-D4.35
SD_CS  (via drill 0.35)
  Top 0.203: v19.7,0.7 19.59,0.59 13.51,0.59 7.3,6.8 v6.95,6.8
  Top 0.254: v6.95,6.8 6.06,6.8 SD1.PIN2
  Bottom 0.203: ESP32-PICO-D4.34 20,5.8 20.55,5.25 20.55,1.55 v19.7,0.7
  Bottom 0.305: R12.1 7.05,6.7 v6.95,6.8
SD_MISO  (via drill 0.35)
  Top 0.203: v18.38,2.27 18.07,1.98 13.62,1.98 9.69,5.91 9.69,10.11 7.65,12.15 v6.75,12.15
  Top 0.254: SD1.PIN7 6.49,12.41 v6.75,12.15
  Bottom 0.203: v18.38,2.27 18.56,2.45 18.56,4.28
  Bottom 0.305: R43.1 7.65,11.25 v6.75,12.15 | 18.56,4.28 ESP32-PICO-D4.38
SD_MOSI  (via drill 0.35)
  Top 0.2: 13.6,1 v6.7,7.9
  Top 0.203: v19.1,1.1 19,1 13.6,1
  Top 0.254: SD1.PIN3 5.86,7.9 v6.7,7.9
  Bottom 0.203: ESP32-PICO-D4.36 19.71,4.65 19.71,2.21 19.1,1.6 v19.1,1.1
  Bottom 0.305: R13.1 7,8.2 v6.7,7.9
SW1  (via drill 0.35)
  Top 0.127: v27.9,17.35 21.5,17.35 20.65,16.5 12.8,16.5 10.05,13.75 10.05,8.17 11.44,6.78 v12.13,6.78 | v28.15,4.55 29.1,5.5 46.37,5.5 49.66,2.21 50.72,2.21 51.43,2.92 v54.9,2.92
  Bottom 0.127: ESP32-PICO-D4.5 13,6.83 12.19,6.83 v12.13,6.78 | v28.15,4.55 27.45,5.25 27.45,16.9 v27.9,17.35 | v54.9,2.92 55.63,2.92 S1.1
SW2  (via drill 0.35)
  Top 0.127: v12.57,7.3 v12.57,7.31 11.46,7.31 10.35,8.42 10.35,13.65 12.95,16.25 20.75,16.25 21.56,17.05 27.45,17.05 27.82,16.68 34.32,16.68 v34.6,16.4
  Bottom 0.127: ESP32-PICO-D4.6 13,7.27 12.61,7.27 v12.57,7.3
  Bottom 0.15: 29.35,37.05 29.35,32.26 34.6,27.01 v34.6,16.4 | S4.1 51.42,38.48 50.2,37.25 29.55,37.25
  Bottom 0.152: 29.55,37.25 29.35,37.05
SW3  (via drill 0.35)
  Top 0.127: v12.05,7.83 10.65,9.23 10.65,13.54 13.1,15.99 20.86,15.99 21.62,16.75 27.35,16.75 27.7,16.4 32.98,16.4 v33.18,16.2 | v25.61,36.61 24.34,36.61 v23.25,37.7
  Bottom 0.127: ESP32-PICO-D4.7 12.08,7.8 v12.05,7.83 | 28.69,32.07 28.69,33.55 25.63,36.61 v25.61,36.61 | v23.25,37.7 23.25,38.55 S3.1
  Bottom 0.15: v33.18,16.2 33.18,27.58 28.69,32.07
SW4  (via drill 0.35)
  Top 0.127: v12.51,8.33 10.9,9.94 10.9,13.4 13.24,15.74 21,15.74 21.71,16.45 27.13,16.45 27.85,15.73 33.5,15.73 33.9,16.13 v33.9,16.2
  Bottom 0.127: ESP32-PICO-D4.8 12.54,8.3 v12.51,8.33
  Bottom 0.15: 29.05,37.25 29.05,32.16 33.9,27.32 v33.9,16.2 | 37,37.53 37.27,37.81 S2.1
  Bottom 0.152: 37,37.53 29.34,37.53 29.05,37.25
V_BAT  (via drill 0.25 pad 0.55, 0.35)
  Top 0.127: 69,15.55 69,15.04 | v23.79,10.26 24.26,9.79 40.43,9.79 44.81,14.17 68.12,14.17
  Top 0.15: 69,15.04 68.12,14.17
  Top 0.152: U5.5 37.06,21.2 v37,21.26 | v35.08,19.28 35,19.2 34.65,19.2
  Top 0.254: v13.3,27.7 13.45,27.7 15,29.25 15,30 v14.9,30.1
  Top 0.305: v25.21,20.88 26.49,22.15 32.95,22.15 U5.6 34.65,21.2 35,20.85 35,19.55 34.65,19.2 U5.10 33.91,17.95 C37.2 | UBLOX_GPS.8 69,15.55
  Top 0.508: C35.P$2 10.4,30.7 v10.05,30.35
  Bottom 0.127: U2.7 10.9,30.75 11.5,31.35 13.83,31.35 14.31,30.87 14.31,30.13 14.19,30.01 | U2.10
  Bottom 0.15: U2.1 10.68,28.39 10.32,28.39 10.13,28.57 10.13,30.13 10.32,30.31 10.68,30.31 U2.6
  Bottom 0.152: 14.12,29.95 14.07,29.95 | 14.07,29.95 U2.10 | 14.19,30.01 14.14,30.01 14.07,29.95 | v37,21.26 35.08,19.34 v35.08,19.28
  Bottom 0.2: v25.21,20.88 25.36,20.73 25.36,13.87 23.79,12.31 v23.79,10.26
  Bottom 0.203: v10.05,30.35 U2.6 U2.7 | 14.12,29.95 14.27,30.1
  Bottom 0.254: U1.32 13.3,26.59 v13.3,27.7 | 14.27,30.1 v14.9,30.1
  Bottom 0.406: v14.9,30.1 14.9,29.9 15.6,29.2 21.84,29.2 25.21,25.83 v25.21,20.88
  Bottom 0.61: BATTERY1.2 8.4,32.75 9,32.15 9,31.4 9.65,30.75 U2.7
  pour Bottom: 11,30.35 9.55,30.35 9.55,31.2 11,31.2
V_LCD  (via drill 0.35)
  Top 0.305: U$5.DISP U$5.VDDA U$5.VDD U$5.EXTMODE
  Top 0.406: v37.98,25.02 37.08,25.92 23.45,25.92 v22.45,24.92
  Top 0.508: C19.2 43.7,6.95 v39.45,6.95 39.3,6.8 U$5.VDDA
  Bottom 0.203: U1.6 16.93,23.15 U1.7
  Bottom 0.305: v39.45,6.95 42.71,3.69 J8.2
  Bottom 0.406: C29.P$2 20.6,24.6 20.92,24.92 v22.45,24.92 | v37.98,25.02 39.9,23.1 v39.9,14.75 39.9,7.4 v39.45,6.95
  Bottom 0.61: C29.P$2 R9.P$2 C11.P$2 16.93,23.15
V_REG  (via drill 0.35, 0.35 pad 0.55)
  Top 0.152: v22.16,24.1 21.96,24.3 21.96,25.17 20,27.14 20,27.15
  Top 0.203: 20,27.15 20,29.13 L2.1
  Top 0.254: v12,21.35 12.45,21.35 C27.P$2 | v12.05,22.4 13.05,23.4 C26.P$2 | v12.1,23.8 13.05,24.75 C25.P$2
  Top 0.305: L5.P$2 v17.7,25.25 | v14,17.45 15.32,18.77 15.32,19.32 15.6,19.59 v15.6,19.65
  Top 0.406: C12.P$2 13.54,27.09 13.55,27.09 13.96,27.5 v14.45,27.5 14.87,27.5 15.19,27.17 15.19,27.15 16.1,26.25 16.34,26 L5.P$2 19.95,29 20.02,29
  Top 0.508: C28.P$2 14.85,20.4 v15.6,19.65 15.32,19.93 15.32,24.44 15.66,24.78 15.66,25.81 16.1,26.25
  Top 0.61: L2.1 20.02,29 | C12.P$2 C25.P$2 C26.P$2 C27.P$2
  Bottom 0.15: 12.15,21.35 11.88,21.62 8.31,21.62 5.57,24.35 R21.P$2
  Bottom 0.2: U1.2 U1.3
  Bottom 0.203: U1.1 U1.2 | U1.14 U1.15 15.6,20.02
  Bottom 0.254: U1.22 12.55,21.75 12.15,21.35 v12,21.35 | v12.05,22.4 12.2,22.55 U1.24 | U1.27 12.15,23.75 v12.1,23.8 | U1.34 14.6,27.35 v14.45,27.5
  Bottom 0.305: U1.2 17.23,25.25 v17.7,25.25 | v14,17.45 14,17.15 R16.P$1 | v22.16,24.1 22.16,23.54 VREG_MODE.3
  Bottom 0.61: v15.6,19.65 15.6,20.02
  pour Top: 12,27.15 18,27.15 18,31.15 21,31.15 21,27.15 18,24.15 18,19.15 12,19.15
V_USB  (via drill 0.35)
  Top 0.406: v15.8,27.4 15.51,27.69 15.51,30.94 14.2,32.25 11.5,32.25 11.3,32.45 v11.3,32.9 | J1.1 4.35,33.1 5.25,34 5.25,35.85 v5.7,36.3
  Top 0.508: FT231.15 11.52,36.06 C7.1 v11.2,35.75
  Bottom 0.203: U1.35 15.24,26.09 U1.36
  Bottom 0.406: v11.3,32.9 11.3,35.65 v11.2,35.75 10.65,36.3 v5.7,36.3 6.2,36.8 C9.P$1
  Bottom 0.61: v15.8,27.4 15.75,27.4 15.24,26.89 15.24,26.09
VCC  (via drill 0.35)
  Top 0.2: R10.2 30.15,31.7 30.15,31.45 30.23,31.38 v30.98,31.38 | C21.1 44.5,18.4 U6.5 44.5,19.52 45.5,20.52 U6.12 45.5,21.12 45.68,21.3 46.49,21.3 46.68,21.12 46.68,19.68 46.49,19.5 46.26,19.5 U6.8 | 45.66,5.19 46.26,5.19 49.54,1.92 50.81,1.92
  Top 0.203: 45.66,5.19 31.44,5.19 C23.1 | 50.81,1.92 50.91,1.92 51.35,2.35
  Top 0.254: 20.07,10.62 20.77,11.32 21.88,11.32 23.75,9.45 40.75,9.45 v41.6,10.3
  Top 0.305: v12.56,4.7 12.55,4.71 v12.55,6.1 | v19.07,3.7 17.95,4.82 17.95,8.5 20.07,10.62 v20.52,10.18 | J4.2 32.44,38.16 v33.95,36.65 | C21.1 42.9,16.8 v40.51,16.8 | v70,2.15 69.8,2.35 51.35,2.35
  Top 0.406: BME280.2 27.38,1.68 | 27.38,1.73 27.38,1.68 | R38.2 25.34,3 26.29,2.05 27.06,2.05 27.38,1.73 | BME280.6 26.71,2.42 27.38,1.76 27.38,1.73 | 27.38,1.68 28.02,2.33 BME280.8 29.26,3.27 C23.1
  Top 0.508: R37.2 22.55,3.7 v19.07,3.7 | v12.25,16.7 10.8,15.25 v10.8,15.2 | v11.38,12.43 12.96,10.84 13.85,10.84 13.85,7.4 v12.55,6.1 | v16.05,3.15 16.05,4.51 14.91,5.64 14.91,9.66 v16.55,11.29
  Top 0.61: v20.4,17.05 20.1,17.05 R28.P$2
  Top 0.813: R37.2 R38.2 | R10.2 R11.2
  Bottom 0.203: U1.17 14.69,20.21 U1.16 | 70.89,3.04 D4.P$1 | ESP32-PICO-D4.19 v16.55,11.29 | v40.51,16.8 40.45,16.86 40.45,20.15
  Bottom 0.254: v41.6,10.3 40.45,11.45 40.45,20.15 40.45,23.85 v39.8,24.5 32.92,31.38 v30.98,31.38
  Bottom 0.305: ESP32-PICO-D4.3 ESP32-PICO-D4.4 12.84,6.1 v12.55,6.1 | v12.56,4.7 12.66,4.8 ESP32-PICO-D4.1 13.05,4.79 13.05,4 13.27,3.78 14.33,3.78 14.55,4 ESP32-PICO-D4.46 14.55,4 14.77,3.78 15.83,3.78 16.05,4 ESP32-PICO-D4.43 v16.05,3.15 16.05,2.55 16.9,1.7 18.6,1.7 19.05,2.15 ESP32-PICO-D4.37 19.07,4.27 v19.07,3.7 | ESP32-PICO-D4.26 20.15,9.8 v20.52,10.18 20.9,9.8 C38.2 | v70,2.15 70.89,3.04 | v30.98,31.38 30.82,31.38 29.75,32.45 29.75,36.8 33.8,36.8 v33.95,36.65
  Bottom 0.508: 14.69,20.21 14.69,20.12 14.71,20.1 14.71,16.65 15.14,16.22 | v20.4,17.05 19.59,17.05 18.76,16.22 15.14,16.22 | v16.05,3.15 | 15.14,16.22 12.73,16.22 v12.25,16.7 | v10.8,15.2 10.74,15.14 10.74,12.88 11,12.62 R1.2 11,12.05 v11.38,12.43
  Bottom 0.61: R26.P$2 19.95,18.65 R28.P$2 20.1,17.05 v20.4,17.05 21.19,17.05 R2.2
  Bottom 1.016: C8.2 C38.2
  pour Top: 10,17.15 22,17.15 22,13.15 18,9.15 18,2.45 13.7,2.45 10,6.15

## Text on the board
tNames: Hikebuddy 2.0 / Dhauladhar | 2020 / Saurabh Gandhi | LCD / GPIO Extension
tValues: ESP_RX | ESP_TX | GND | VCC | GND | SCL | SDA | RX | TX | I2C Extension | GND | RESET | GPIO/ / Flash | V_GPS / (3.3V) | SAFEBOOT | GPS / UART Extension | VCC (LCD) | IO33 | IO32 | IO13 | IO15 | GND